# EAGLE board USB2LPT_1.7_adapter (EAGLE 7.5.0)
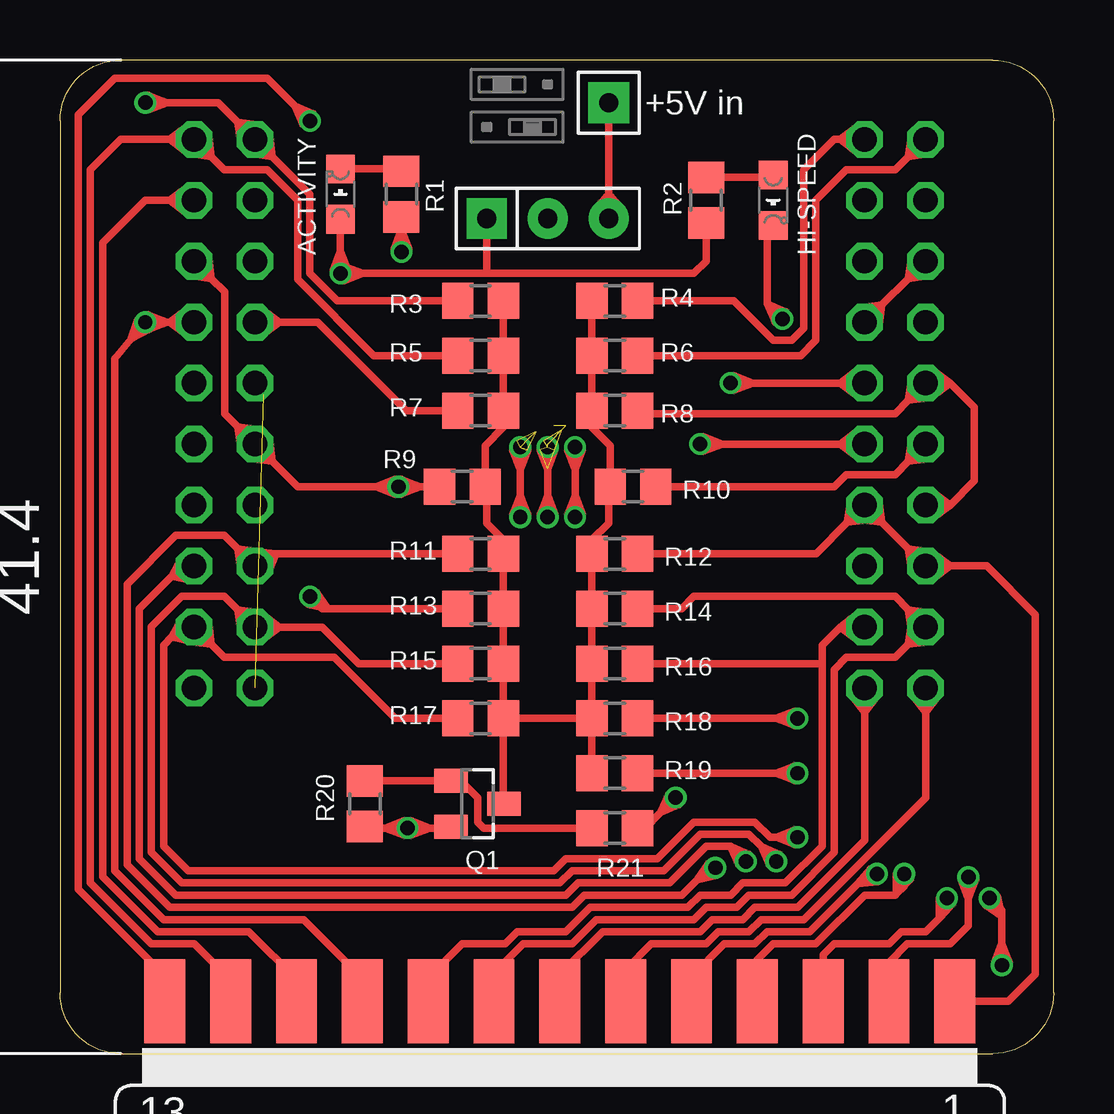
[diagram p1: board, top side]
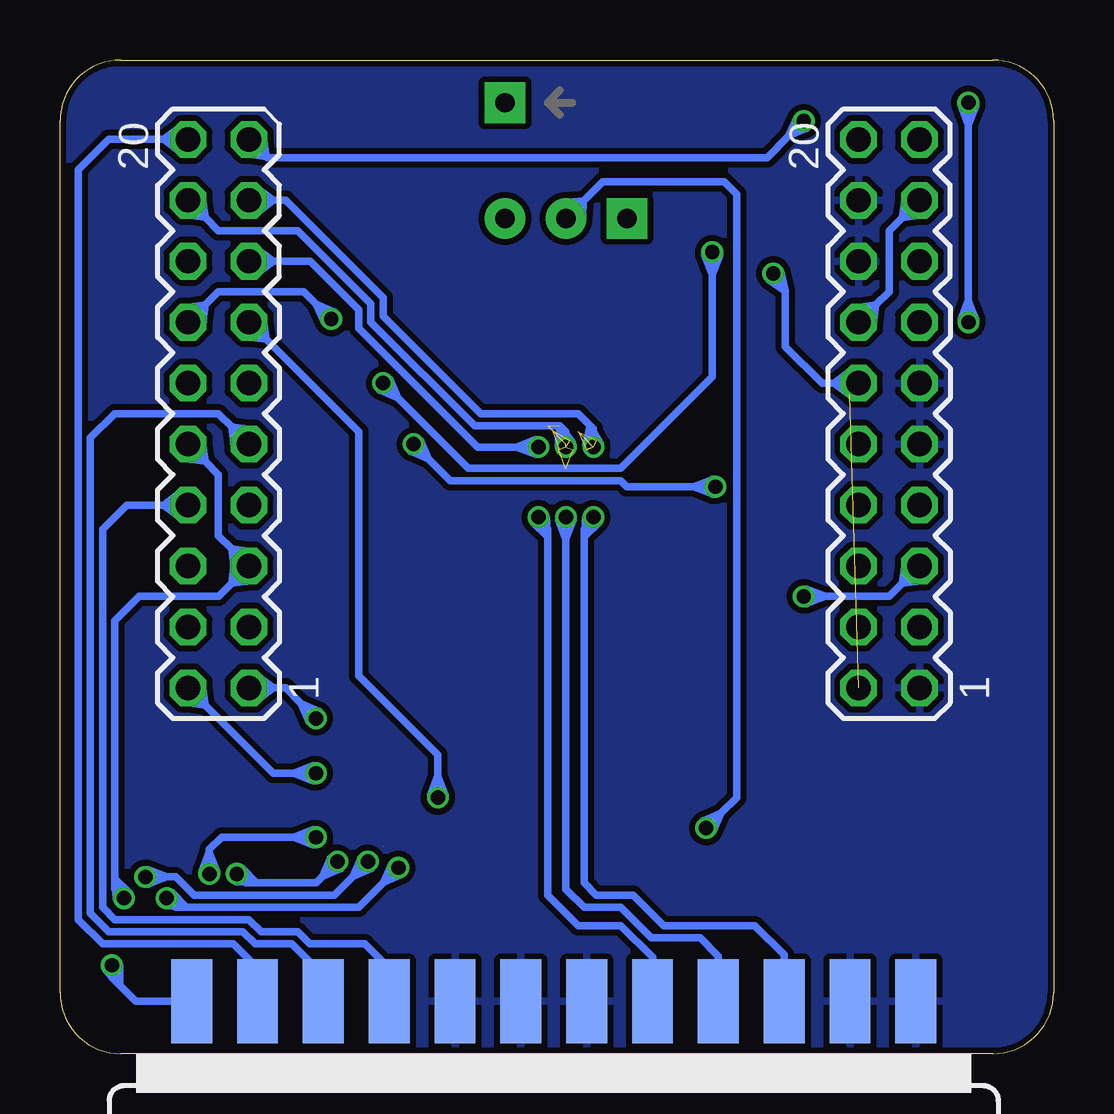
[diagram p2: board, bottom side, seen from below]

Size 41.4 x 41.4 mm. Coordinates in mm from the lower left corner, seen from the top.
Outline: 41.4,2.54 41.4,38.86 arc90 38.86,41.4 2.54,41.4 arc90 0,38.86 0,2.54 arc90 2.54,0 38.86,0 arc90 41.4,2.54
Copper layers (1*16): Top 0.035mm / dielectric 1.5mm / Bottom 0.035mm
Design rules "SeeedStudio_2layer_DRU_no_angle_20140221": minimum track width 6mil, minimum drill 12mil, track to track 6mil, track to pad 6mil, pad to pad 6mil, via to via 6mil, smd to smd 0mil, copper to edge 10mil, drill to drill 10mil, minimum pad ring 10mil, minimum via ring 6mil, stop-mask expansion 2mil, vias tented up to drill 100mil, thermal gap 10mil

## Footprints (pad centres in the part's own frame; a part is rotated, then mirrored left to right if it is on the bottom)
M1X2_08_17 = drill 0.8 pad 1.7 square: 1 0,0
LED-805 = smd 1.2 x 1.2: A 0,-1.05; C 0,1.05
SOT-23 = smd 1 x 1.4: 1 -0.95,-1.1; 2 0.95,-1.1; 3 0,1.1
R805 = smd 1.3 x 1.5: 1 -0.95,0; 2 0.95,0
HEADER_1X3 = drill 0.8 pad 1.676 square: 1 -2.54,0 | drill 0.8 pad 1.676: 2 0,0; 3 2.54,0
F25D = smd 1.7 x 3.5: 1 -16.459,-6.045; 2 -13.716,-6.045; 3 -10.973,-6.045; 4 -8.23,-6.045; 5 -5.486,-6.045; 6 -2.743,-6.045; 7 0,-6.045; 8 2.743,-6.045; 9 5.486,-6.045; 10 8.23,-6.045; 11 10.973,-6.045; 12 13.716,-6.045; 13 16.459,-6.045 | smd 1.7 x 3.5 bottom: 14 -15.088,-6.045; 15 -12.344,-6.045; 16 -9.601,-6.045; 17 -6.858,-6.045; 18 -4.115,-6.045; 19 -1.372,-6.045; 20 1.372,-6.045; 21 4.115,-6.045; 22 6.858,-6.045; 23 9.601,-6.045; 24 12.344,-6.045; 25 15.088,-6.045
MA10-2 = drill 1.016 octagon: 1 -11.43,-1.27; 2 -11.43,1.27; 3 -8.89,-1.27; 4 -8.89,1.27; 5 -6.35,-1.27; 6 -6.35,1.27; 7 -3.81,-1.27; 8 -3.81,1.27; 9 -1.27,-1.27; 10 -1.27,1.27; 11 1.27,-1.27; 12 1.27,1.27; 13 3.81,-1.27; 14 3.81,1.27; 15 6.35,-1.27; 16 6.35,1.27; 17 8.89,-1.27; 18 8.89,1.27; 19 11.43,-1.27; 20 11.43,1.27

## Placement (x,y rotation side)
$$U$2  [JUMP3_DESC_RIGHT]  19.05,38.61 0 top
+5V  CON_HEADER_1X01-PTH_08_17  [M1X2_08_17]  22.86,39.62 0 top
ACTIVITY  [LED-805]  11.68,35.81 0 top
HI-SPEED  [LED-805]  29.72,35.56 180 top
Q1  [SOT-23]  17.4,10.41 270 top
R1  470  [R805]  14.22,35.81 90 top
R2  470  [R805]  26.92,35.56 270 top
R3  4K7  [R805]  17.53,31.37 0 top
R4  4K7  [R805]  23.11,31.37 180 top
R5  4K7  [R805]  17.53,29.08 0 top
R6  4K7  [R805]  23.11,29.08 180 top
R7  4K7  [R805]  17.53,26.8 0 top
R8  2K2  [R805]  23.11,26.8 180 top
R9  2K2  [R805]  16.76,23.62 0 top
R10  2K2  [R805]  23.88,23.62 180 top
R11  4K7  [R805]  17.53,20.83 0 top
R12  2K2  [R805]  23.11,20.83 180 top
R13  4K7  [R805]  17.53,18.54 0 top
R14  4K7  [R805]  23.11,18.54 180 top
R15  4K7  [R805]  17.53,16.26 0 top
R16  4K7  [R805]  23.11,16.26 180 top
R17  4K7  [R805]  17.53,13.97 0 top
R18  4K7  [R805]  23.11,13.97 180 top
R19  4K7  [R805]  23.11,11.68 180 top
R20  470  [R805]  12.7,10.41 90 top
R21  470  [R805]  23.11,9.4 0 top
U$1  [JUMP3_DESC_LEFT]  19.05,40.39 0 top
VSELECT  VSELECT_HEADER  [HEADER_1X3]  20.32,34.8 0 top
X1  [F25D]  20.83,-3.87 180 top
X100  [MA10-2]  34.8,26.67 90 bottom
X101  [MA10-2]  6.86,26.67 90 bottom

## Tracks (layer width: path | path; a pad name or v marks a point on that pad's centre or on a via)
5V_PAD
  Top 0.305: +5V.1 22.86,35.6 | 22.86,35.6 | 22.86,35.6 | 22.86,35.6 | 22.86,35.6 | 22.86,35.6 VSELECT.3
  Top 0.61: 22.86,35.6 22.46,35.15 VSELECT.3 23.26,35.15 22.86,35.6
+3V3  (via drill 0.6)  (1 unrouted)
  Top 0.305: ACTIVITY.A 11.68,33.41 | 11.68,33.41 v11.68,32.51 | v11.68,32.51 12.58,32.51 | 12.58,32.51 17.78,32.51 | 17.78,32.51 26.42,32.51 26.92,33.02 R2.2 | VSELECT.1 17.78,32.51 | 11.68,33.41 11.4,32.61 v11.68,32.51 | 11.68,33.41 11.97,32.61 v11.68,32.51 | 12.58,32.51 11.78,32.8 v11.68,32.51 | 12.58,32.51 11.78,32.23 v11.68,32.51 | 11.68,33.41 11.38,32.63 | 11.38,32.63 | 12.58,32.51 11.8,32.81 | 11.8,32.81 | 11.68,33.41 11.38,32.63 | v11.68,32.51 11.38,32.63 | 11.68,33.41 11.99,32.63 | 11.99,32.63 | 11.68,33.41 | 11.68,33.41 11.99,32.63 | v11.68,32.51 11.99,32.63 | 12.58,32.51 11.8,32.81 | v11.68,32.51 11.8,32.81 | 12.58,32.51 | 12.58,32.51 11.8,32.21 | 11.8,32.21 | 12.58,32.51 11.8,32.21 | v11.68,32.51 11.8,32.21 | 11.68,33.41 11.38,32.63 | 11.38,32.63 | 11.68,33.41 11.38,32.63 | v11.68,32.51 11.38,32.63 | 11.68,33.41 11.99,32.63 | 11.99,32.63 | v11.68,32.51 11.99,32.63 | 11.68,33.41 11.38,32.63 | 11.68,33.41 11.99,32.63 | 11.68,33.41 11.38,32.63 | v11.68,32.51 11.38,32.63 | 11.68,33.41 11.99,32.63 | v11.68,32.51 11.99,32.63 | 12.58,32.51 11.8,32.21 | 11.8,32.21 | 12.58,32.51 11.8,32.81 | 11.8,32.81 | v11.68,32.51 11.8,32.81 | 12.58,32.51 11.8,32.21 | v11.68,32.51 11.8,32.21 | 12.58,32.51 11.8,32.81 | v11.68,32.51 11.8,32.81 | 12.58,32.51 11.8,32.21 | v11.68,32.51 11.8,32.21
  Bottom 0.305: X101.12 9.14,27.94 | 9.14,27.94 | 9.14,27.94 9.65,27.94 11.18,29.46 11.18,31.75 11.19,31.76 | 11.19,31.76 v11.68,32.51 | 11.19,31.76 11.86,32.27 v11.68,32.51 | 11.19,31.76 11.39,32.59 v11.68,32.51 | 11.19,31.76 11.87,32.25 v11.68,32.51 | 11.19,31.76 11.37,32.58 v11.68,32.51 | 9.14,27.94 8.49,28.42 | 9.14,27.94 8.49,28.42 | 8.49,28.42 | 9.14,27.94 | 9.14,27.94 8.49,28.42 | X101.12 8.49,28.42 | 9.14,27.94 | 9.14,27.94 8.49,28.42 | 9.14,27.94 | 9.14,27.94 8.49,27.45 | X101.12 8.49,27.45 | 9.14,27.94 8.49,28.42 | 8.49,28.42 | 9.14,27.94 8.49,27.45 | 9.14,27.94 8.49,28.42 | X101.12 8.49,28.42 | 9.14,27.94 8.49,27.45 | 8.49,27.45 | X101.12 8.49,27.45 | 9.14,27.94 8.49,28.42 | X101.12 8.49,28.42 | 9.14,27.94 8.49,27.45 | X101.12 8.49,27.45 | 9.14,27.94 8.49,28.42 | X101.12 8.49,28.42 | 9.14,27.94 8.49,27.45 | X101.12 8.49,27.45
CTL0
  Top 0.305: X100.7 34.25,22.14 | 34.25,22.14 35.35,21.03 | 35.35,21.03 X100.6 | X100.6 37.08,20.32 | 37.08,20.32 38.61,20.32 40.64,18.29 40.64,3.3 39.52,2.18 X1.1 | R12.1 31.5,20.83 32.81,22.14 | X100.7 | 32.81,22.14 X100.7 | 35.35,21.03 35.46,20.23 X100.6 | 35.35,21.03 36.15,20.92 X100.6 | 37.08,20.32 36.43,20.8 X100.6 | 37.08,20.32 36.44,19.83 X100.6 | 34.25,22.14 34.13,22.94 X100.7 | 34.25,22.14 33.44,22.25 X100.7 | 32.81,22.14 33.61,22.25 X100.7 | 32.81,22.14 32.92,22.94 X100.7
CTL1  (via drill 0.6)
  Top 0.305: 35.35,24.68 34.8,24.13 32.77,24.13 32.26,23.62 R10.1 | 35.35,24.68 X100.10 | v38.73,6.48 39.24,5.97 39.24,5.73 | 39.24,5.73 39.24,4.58 | 39.24,4.58 v39.24,3.68 | 39.24,5.73 39.02,6.55 v38.73,6.48 | 39.24,5.73 38.56,6.24 v38.73,6.48 | 39.24,4.58 38.96,3.78 v39.24,3.68 | 39.24,4.58 39.53,3.78 v39.24,3.68 | 39.24,5.73 39.05,6.55 v38.73,6.48 | 39.24,5.73 38.55,6.21 v38.73,6.48 | 39.24,4.58 38.94,3.8 | 38.94,3.8 | 39.24,4.58 38.94,3.8 | v39.24,3.68 38.94,3.8 | 39.24,4.58 39.55,3.8 | 39.55,3.8 | 39.24,4.58 | 39.24,4.58 39.55,3.8 | v39.24,3.68 39.55,3.8 | 39.24,4.58 38.94,3.8 | 38.94,3.8 | 39.24,4.58 38.94,3.8 | v39.24,3.68 38.94,3.8 | 39.24,4.58 39.55,3.8 | 39.55,3.8 | v39.24,3.68 39.55,3.8 | 39.24,4.58 38.94,3.8 | 39.24,4.58 39.55,3.8 | 39.24,4.58 38.94,3.8 | v39.24,3.68 38.94,3.8 | 39.24,4.58 39.55,3.8 | v39.24,3.68 39.55,3.8 | 35.35,24.68 36.15,24.79 X100.10 | 35.35,24.68 35.46,25.48 X100.10
  Bottom 0.305: 34.25,19.6 34.79,19.05 38.1,19.05 39.12,18.03 39.12,7.29 | 34.25,19.6 X100.5 | X100.5 34.25,21.03 | 34.25,21.03 34.8,21.59 34.8,24.13 35.35,24.68 | 35.35,24.68 X100.10 | 39.12,7.29 39.12,6.86 v38.73,6.48 | 36.02,2.29 X1.14 38.25,2.18 38.91,2.85 | v39.24,3.68 39.24,3.18 38.91,2.85 | 39.12,7.29 38.52,6.69 v38.73,6.48 | 39.12,7.29 39.03,6.45 v38.73,6.48 | 38.91,2.85 39.47,3.49 v39.24,3.68 | 38.91,2.85 38.94,3.69 v39.24,3.68 | 39.12,7.29 38.51,6.71 v38.73,6.48 | 39.12,7.29 39.06,6.46 v38.73,6.48 | 38.91,2.85 39.48,3.46 | v39.24,3.68 39.48,3.46 | 38.91,2.85 | 38.91,2.85 38.92,3.69 | v39.24,3.68 38.92,3.69 | 38.91,2.85 39.48,3.46 | v39.24,3.68 39.48,3.46 | 38.91,2.85 38.92,3.69 | v39.24,3.68 38.92,3.69 | 34.25,19.6 34.13,20.4 X100.5 | 34.25,19.6 33.44,19.71 X100.5 | 34.25,21.03 33.44,20.92 X100.5 | 34.25,21.03 34.13,20.23 X100.5 | 35.35,24.68 36.15,24.79 X100.10 | 35.35,24.68 35.46,25.48 X100.10
CTL2
  Top 0.305: X100.12 37.08,27.94 | 37.08,27.94 | 37.08,27.94 37.09,27.94 38.1,26.92 38.1,23.87 37.08,22.86 | 37.08,22.86 X100.8 | X100.12 35.35,27.22 | 35.35,27.22 34.8,26.67 24.19,26.67 R8.1 | 37.08,22.86 36.43,23.34 | 37.08,22.86 36.43,23.34 | 36.43,23.34 | 37.08,22.86 | 37.08,22.86 36.43,23.34 | X100.8 36.43,23.34 | 37.08,22.86 | 37.08,22.86 36.43,23.34 | 37.08,22.86 | 37.08,22.86 36.43,22.37 | X100.8 36.43,22.37 | 37.08,22.86 36.43,23.34 | 36.43,23.34 | 37.08,22.86 36.43,22.37 | 37.08,22.86 36.43,23.34 | X100.8 36.43,23.34 | 37.08,22.86 36.43,22.37 | 36.43,22.37 | X100.8 36.43,22.37 | 37.08,22.86 36.43,23.34 | X100.8 36.43,23.34 | 37.08,22.86 36.43,22.37 | X100.8 36.43,22.37 | 37.08,22.86 36.43,23.34 | X100.8 36.43,23.34 | 37.08,22.86 36.43,22.37 | X100.8 36.43,22.37 | 37.08,27.94 36.43,28.42 | 37.08,27.94 36.43,28.42 | 36.43,28.42 | 37.08,27.94 | 37.08,27.94 36.43,28.42 | X100.12 36.43,28.42 | 37.08,27.94 | 37.08,27.94 36.43,28.42 | 37.08,27.94 | 37.08,27.94 36.43,27.45 | X100.12 36.43,27.45 | 37.08,27.94 36.43,28.42 | 36.43,28.42 | 37.08,27.94 36.43,27.45 | 37.08,27.94 36.43,28.42 | X100.12 36.43,28.42 | 37.08,27.94 36.43,27.45 | 36.43,27.45 | X100.12 36.43,27.45 | 37.08,27.94 36.43,28.42 | X100.12 36.43,28.42 | 37.08,27.94 36.43,27.45 | X100.12 36.43,27.45 | 37.08,27.94 36.43,28.42 | X100.12 36.43,28.42 | 37.08,27.94 36.43,27.45 | X100.12 36.43,27.45 | 35.35,27.22 36.15,27.33 X100.12 | 35.35,27.22 35.46,28.02 X100.12
  Bottom 0.305: X100.8 37.08,22.86 | 37.08,22.86 | 37.08,22.86 38.61,22.86 39.62,21.84 39.62,6.1 39.12,5.59 33.53,5.59 33.02,5.08 31.5,5.08 30.99,4.57 28.7,4.57 27.94,3.81 27.94,2.43 X1.17 | 37.08,22.86 36.43,23.34 | 37.08,22.86 36.43,23.34 | 36.43,23.34 | 37.08,22.86 | 37.08,22.86 36.43,23.34 | X100.8 36.43,23.34 | 37.08,22.86 | 37.08,22.86 36.43,23.34 | 37.08,22.86 | 37.08,22.86 36.43,22.37 | X100.8 36.43,22.37 | 37.08,22.86 36.43,23.34 | 36.43,23.34 | 37.08,22.86 36.43,22.37 | 37.08,22.86 36.43,23.34 | X100.8 36.43,23.34 | 37.08,22.86 36.43,22.37 | 36.43,22.37 | X100.8 36.43,22.37 | 37.08,22.86 36.43,23.34 | X100.8 36.43,23.34 | 37.08,22.86 36.43,22.37 | X100.8 36.43,22.37 | 37.08,22.86 36.43,23.34 | X100.8 36.43,23.34 | 37.08,22.86 36.43,22.37 | X100.8 36.43,22.37
GND
  pour Bottom (isolate 0.254): -1.78,-2.03 43.69,-2.29 43.69,42.67 -1.78,42.67
IFCLK  (via drill 0.6)
  Top 0.305: X101.15 6.31,32.3 | 6.31,32.3 6.86,31.75 6.86,26.67 7.41,26.12 | 7.41,26.12 X101.10 | X101.10 | X101.10 8.85,24.68 | 8.85,24.68 9.91,23.62 13.2,23.62 | 13.2,23.62 v14.1,23.62 | v14.1,23.62 15,23.62 | 15,23.62 R9.1 | v26.67,25.4 27.57,25.4 | 27.57,25.4 32.51,25.4 | 32.51,25.4 X100.9 | 13.2,23.62 14,23.34 v14.1,23.62 | 13.2,23.62 14,23.91 v14.1,23.62 | 15,23.62 14.2,23.91 v14.1,23.62 | 15,23.62 14.2,23.34 v14.1,23.62 | 27.57,25.4 26.77,25.68 v26.67,25.4 | 27.57,25.4 26.77,25.12 v26.67,25.4 | 13.2,23.62 13.98,23.32 | 13.98,23.32 | 15,23.62 14.21,23.93 | 14.21,23.93 | 13.2,23.62 13.98,23.32 | v14.1,23.62 13.98,23.32 | 13.2,23.62 13.98,23.93 | 13.98,23.93 | 13.2,23.62 | 13.2,23.62 13.98,23.93 | v14.1,23.62 13.98,23.93 | 15,23.62 14.21,23.93 | v14.1,23.62 14.21,23.93 | 15,23.62 | 15,23.62 14.21,23.32 | 14.21,23.32 | 15,23.62 14.21,23.32 | v14.1,23.62 14.21,23.32 | 13.2,23.62 13.98,23.32 | 13.98,23.32 | 13.2,23.62 13.98,23.32 | v14.1,23.62 13.98,23.32 | 13.2,23.62 13.98,23.93 | 13.98,23.93 | v14.1,23.62 13.98,23.93 | 13.2,23.62 13.98,23.32 | 13.2,23.62 13.98,23.93 | 13.2,23.62 13.98,23.32 | v14.1,23.62 13.98,23.32 | 13.2,23.62 13.98,23.93 | v14.1,23.62 13.98,23.93 | 15,23.62 14.21,23.32 | 14.21,23.32 | 15,23.62 14.21,23.93 | 14.21,23.93 | v14.1,23.62 14.21,23.93 | 15,23.62 14.21,23.32 | v14.1,23.62 14.21,23.32 | 15,23.62 14.21,23.93 | v14.1,23.62 14.21,23.93 | 15,23.62 14.21,23.32 | v14.1,23.62 14.21,23.32 | 27.57,25.4 26.79,25.7 | 26.79,25.7 | 27.57,25.4 26.79,25.7 | v26.67,25.4 26.79,25.7 | 27.57,25.4 | 27.57,25.4 26.79,25.1 | 26.79,25.1 | 27.57,25.4 26.79,25.1 | v26.67,25.4 26.79,25.1 | 27.57,25.4 26.79,25.1 | 26.79,25.1 | 27.57,25.4 26.79,25.7 | 26.79,25.7 | v26.67,25.4 26.79,25.7 | 27.57,25.4 26.79,25.1
  Top 0.305: v26.67,25.4 26.79,25.1 | 27.57,25.4 26.79,25.7 | v26.67,25.4 26.79,25.7 | 27.57,25.4 26.79,25.1 | v26.67,25.4 26.79,25.1 | 7.41,26.12 7.52,25.31 X101.10 | 7.41,26.12 8.22,26 X101.10 | 8.85,24.68 8.73,25.48 X101.10 | 8.85,24.68 8.04,24.79 X101.10 | 6.31,32.3 6.19,33.1 X101.15 | 6.31,32.3 5.5,32.41 X101.15 | 32.51,25.4 33.16,24.91 X100.9 | 32.51,25.4 33.16,25.89 X100.9
  Bottom 0.305: X100.9 | v26.67,25.4 26.03,24.76 | 26.03,24.76 25.15,23.88 18.03,23.88 17.78,23.62 15,23.62 | X100.9 34.25,26.11 | 34.25,26.11 34.8,26.67 39.12,26.67 40.13,25.65 40.13,5.84 39.37,5.08 33.78,5.08 33.27,4.57 31.75,4.57 30.23,3.05 30.23,2.38 X1.16 | v14.1,23.62 15,23.62 | 15,23.62 14.2,23.91 v14.1,23.62 | 15,23.62 14.2,23.34 v14.1,23.62 | 26.03,24.76 26.8,25.13 v26.67,25.4 | 26.03,24.76 26.4,25.53 v26.67,25.4 | 15,23.62 14.21,23.93 | 14.21,23.93 | 15,23.62 14.21,23.93 | v14.1,23.62 14.21,23.93 | 15,23.62 | 15,23.62 14.21,23.32 | 14.21,23.32 | 15,23.62 14.21,23.32 | v14.1,23.62 14.21,23.32 | 15,23.62 14.21,23.32 | 14.21,23.32 | 15,23.62 14.21,23.93 | 14.21,23.93 | v14.1,23.62 14.21,23.93 | 15,23.62 14.21,23.32 | v14.1,23.62 14.21,23.32 | 15,23.62 14.21,23.93 | v14.1,23.62 14.21,23.93 | 15,23.62 14.21,23.32 | v14.1,23.62 14.21,23.32 | 26.03,24.76 26.8,25.1 v26.67,25.4 | 26.03,24.76 26.37,25.53 v26.67,25.4 | 34.25,26.11 33.44,26 X100.9 | 34.25,26.11 34.13,25.31 X100.9
N$1
  Top 0.305: R2.1 29.72,36.51 HI-SPEED.A
N$5
  Top 0.305: 14.12,36.86 R1.2 13.87,36.86 ACTIVITY.C
N$8
  Top 0.305: R20.2 Q1.1 | R21.1 17.65,9.4 17.4,9.65 17.4,10.67 16.7,11.36 Q1.1 | 16.83,11.36 Q1.1
PA4  (via drill 0.6)
  Top 0.305: X100.11 | v27.94,27.94 28.84,27.94 | 28.84,27.94 32.51,27.94 | 32.51,27.94 X100.11 | v14.22,33.4 14.22,34.3 | 14.22,34.3 R1.1 | 14.22,34.3 13.94,33.5 v14.22,33.4 | 14.22,34.3 14.51,33.5 v14.22,33.4 | 28.84,27.94 28.04,28.22 v27.94,27.94 | 28.84,27.94 28.04,27.66 v27.94,27.94 | 14.22,34.3 13.92,33.52 | 13.92,33.52 | 14.22,34.3 13.92,33.52 | v14.22,33.4 13.92,33.52 | 14.22,34.3 14.53,33.52 | 14.53,33.52 | 14.22,34.3 | 14.22,34.3 14.53,33.52 | v14.22,33.4 14.53,33.52 | 14.22,34.3 13.92,33.52 | 13.92,33.52 | 14.22,34.3 13.92,33.52 | v14.22,33.4 13.92,33.52 | 14.22,34.3 14.53,33.52 | 14.53,33.52 | v14.22,33.4 14.53,33.52 | 14.22,34.3 13.92,33.52 | 14.22,34.3 14.53,33.52 | 14.22,34.3 13.92,33.52 | v14.22,33.4 13.92,33.52 | 14.22,34.3 14.53,33.52 | v14.22,33.4 14.53,33.52 | 28.84,27.94 28.06,28.24 | 28.06,28.24 | 28.84,27.94 28.06,28.24 | v27.94,27.94 28.06,28.24 | 28.84,27.94 | 28.84,27.94 28.06,27.64 | 28.06,27.64 | 28.84,27.94 28.06,27.64 | v27.94,27.94 28.06,27.64 | 28.84,27.94 28.06,27.64 | 28.06,27.64 | 28.84,27.94 28.06,28.24 | 28.06,28.24 | v27.94,27.94 28.06,28.24 | 28.84,27.94 28.06,27.64 | v27.94,27.94 28.06,27.64 | 28.84,27.94 28.06,28.24 | v27.94,27.94 28.06,28.24 | 28.84,27.94 28.06,27.64 | v27.94,27.94 28.06,27.64 | 32.51,27.94 33.16,27.45 X100.11 | 32.51,27.94 33.16,28.43 X100.11
  Bottom 0.305: v14.22,33.4 14.22,32.5 | 14.22,32.5 14.22,28.19 18.03,24.38 24.38,24.38 27.3,27.3 | 27.3,27.3 v27.94,27.94 | 14.22,32.5 14.51,33.3 v14.22,33.4 | 14.22,32.5 13.94,33.3 v14.22,33.4 | 27.3,27.3 28.07,27.67 v27.94,27.94 | 27.3,27.3 27.67,28.07 v27.94,27.94 | 14.22,32.5 14.53,33.28 | 14.53,33.28 | 14.22,32.5 14.53,33.28 | v14.22,33.4 14.53,33.28 | 14.22,32.5 | 14.22,32.5 13.92,33.28 | 13.92,33.28 | 14.22,32.5 13.92,33.28 | v14.22,33.4 13.92,33.28 | 14.22,32.5 13.92,33.28 | 13.92,33.28 | 14.22,32.5 14.53,33.28 | 14.53,33.28 | v14.22,33.4 14.53,33.28 | 14.22,32.5 13.92,33.28 | v14.22,33.4 13.92,33.28 | 14.22,32.5 14.53,33.28 | v14.22,33.4 14.53,33.28 | 14.22,32.5 13.92,33.28 | v14.22,33.4 13.92,33.28 | 27.3,27.3 28.07,27.64 v27.94,27.94 | 27.3,27.3 27.64,28.07 v27.94,27.94
PA5  (via drill 0.6)
  Top 0.305: 29.46,31.25 29.46,31.24 v30.1,30.61 | 29.46,31.25 29.83,30.48 v30.1,30.61 | 29.46,31.25 30.23,30.88 v30.1,30.61 | 29.46,31.25 29.8,30.48 v30.1,30.61 | 29.46,31.25 30.23,30.9 v30.1,30.61 | HI-SPEED.C 29.46,34.51 29.46,31.25
  Bottom 0.305: 35.35,31.2 34.8,31.75 31.24,31.75 30.73,31.24 | 35.35,31.2 X100.14 | 30.73,31.24 v30.1,30.61 | 30.73,31.24 29.97,30.88 v30.1,30.61 | 30.73,31.24 30.37,30.48 v30.1,30.61 | 30.73,31.24 29.97,30.9 v30.1,30.61 | 30.73,31.24 30.4,30.48 v30.1,30.61 | 35.35,31.2 35.46,30.39 X100.14 | 35.35,31.2 36.16,31.08 X100.14
PA6  (via drill 0.6)
  Top 0.305: X100.16 35.35,32.3 | 35.35,32.3 34.25,31.19 | 34.25,31.19 X100.13 | R21.2 24.38,9.4 25.02,10.03 | 25.02,10.03 v25.65,10.67 | 25.02,10.03 25.78,10.4 v25.65,10.67 | 25.02,10.03 25.38,10.8 v25.65,10.67 | 25.02,10.03 25.79,10.37 v25.65,10.67 | 25.02,10.03 25.36,10.8 v25.65,10.67 | 34.25,31.19 33.44,31.08 X100.13 | 34.25,31.19 34.13,30.39 X100.13 | 35.35,32.3 36.15,32.41 X100.16 | 35.35,32.3 35.46,33.1 X100.16
  Bottom 0.305: 32.81,29.76 28.96,25.9 28.96,15.75 25.65,12.45 25.65,11.57 | 32.81,29.76 X100.13 | v25.65,10.67 25.65,11.57 | 25.65,11.57 25.37,10.77 v25.65,10.67 | 25.65,11.57 25.94,10.77 v25.65,10.67 | 25.65,11.57 25.35,10.79 | 25.35,10.79 | 25.65,11.57 25.35,10.79 | v25.65,10.67 25.35,10.79 | 25.65,11.57 25.96,10.79 | 25.96,10.79 | 25.65,11.57 | 25.65,11.57 25.96,10.79 | v25.65,10.67 25.96,10.79 | 25.65,11.57 25.35,10.79 | 25.35,10.79 | 25.65,11.57 25.35,10.79 | v25.65,10.67 25.35,10.79 | 25.65,11.57 25.96,10.79 | 25.96,10.79 | v25.65,10.67 25.96,10.79 | 25.65,11.57 25.35,10.79 | 25.65,11.57 25.96,10.79 | 25.65,11.57 25.35,10.79 | v25.65,10.67 25.35,10.79 | 25.65,11.57 25.96,10.79 | v25.65,10.67 25.96,10.79 | 32.81,29.76 33.61,29.87 X100.13 | 32.81,29.76 32.92,30.56 X100.13
PB0  (via drill 0.6)  (1 unrouted)
  Top 0.305: 34.54,1.52 X1.2 34.54,3.81 35.31,4.57 37.08,4.57 37.85,5.33 37.85,6.47 | X101.5 5.08,20.32 4.66,19.9 | 4.66,19.9 3.3,18.54 3.3,8.13 4.83,6.6 21.08,6.6 21.59,7.11 25.4,7.11 26.92,8.64 27.94,8.64 | v37.85,7.37 37.85,6.47 | R13.1 11.16,18.54 | 11.16,18.54 10.92,18.54 v10.41,19.05 | 11.16,18.54 10.66,19.23 v10.41,19.05 | 11.16,18.54 10.34,18.76 v10.41,19.05 | 37.85,6.47 38.13,7.27 v37.85,7.37 | 37.85,6.47 37.56,7.27 v37.85,7.37 | 27.94,8.64 | 27.94,8.64 v28.57,8 | 11.16,18.54 10.68,19.23 v10.41,19.05 | 11.16,18.54 10.34,18.73 v10.41,19.05 | 37.85,6.47 38.15,7.25 | 38.15,7.25 | 37.85,6.47 38.15,7.25 | v37.85,7.37 38.15,7.25 | 37.85,6.47 | 37.85,6.47 37.54,7.25 | 37.54,7.25 | 37.85,6.47 37.54,7.25 | v37.85,7.37 37.54,7.25 | 37.85,6.47 37.54,7.25 | 37.54,7.25 | 37.85,6.47 38.15,7.25 | 38.15,7.25 | v37.85,7.37 38.15,7.25 | 37.85,6.47 37.54,7.25 | v37.85,7.37 37.54,7.25 | 37.85,6.47 38.15,7.25 | v37.85,7.37 38.15,7.25 | 37.85,6.47 37.54,7.25 | v37.85,7.37 37.54,7.25 | 27.94,8.64 28.28,7.87 v28.57,8 | 27.94,8.64 28.71,8.3 | v28.57,8 28.71,8.3 | 27.94,8.64 28.28,7.87 v28.57,8 | 27.94,8.64 28.71,8.3 | v28.57,8 28.71,8.3 | 4.66,19.9 5.45,19.72 X101.5 | 4.66,19.9 5.05,20.61 X101.5
  Bottom 0.305: X101.5 6.31,19.6 | 6.31,19.6 6.85,19.05 9.51,19.05 | 9.51,19.05 v10.41,19.05 | 29.21,7.37 29.97,6.6 35.81,6.6 36.58,7.37 36.95,7.37 | 29.21,7.37 v28.57,8 | 36.95,7.37 v37.85,7.37 | 9.51,19.05 10.31,18.77 v10.41,19.05 | 9.51,19.05 10.31,19.33 v10.41,19.05 | 36.95,7.37 37.75,7.08 v37.85,7.37 | 36.95,7.37 37.75,7.65 v37.85,7.37 | 29.21,7.37 28.85,8.13 v28.57,8 | 29.21,7.37 28.45,7.73 v28.57,8 | 9.51,19.05 10.3,18.75 | 10.3,18.75 | 9.51,19.05 10.3,18.75 | v10.41,19.05 10.3,18.75 | 9.51,19.05 10.3,19.35 | 10.3,19.35 | 9.51,19.05 | 9.51,19.05 10.3,19.35 | v10.41,19.05 10.3,19.35 | 9.51,19.05 10.3,18.75 | 10.3,18.75 | 9.51,19.05 10.3,18.75 | v10.41,19.05 10.3,18.75 | 9.51,19.05 10.3,19.35 | 10.3,19.35 | v10.41,19.05 10.3,19.35 | 9.51,19.05 10.3,18.75 | 9.51,19.05 10.3,19.35 | 9.51,19.05 10.3,18.75 | v10.41,19.05 10.3,18.75 | 9.51,19.05 10.3,19.35 | v10.41,19.05 10.3,19.35 | 36.95,7.37 37.73,7.06 | 37.73,7.06 | 36.95,7.37 37.73,7.06 | v37.85,7.37 37.73,7.06 | 36.95,7.37 37.73,7.67 | 37.73,7.67 | 36.95,7.37 | 36.95,7.37 37.73,7.67 | v37.85,7.37 37.73,7.67 | 36.95,7.37 37.73,7.06 | 37.73,7.06 | 36.95,7.37 37.73,7.06 | v37.85,7.37 37.73,7.06 | 36.95,7.37 37.73,7.67 | 37.73,7.67 | v37.85,7.37 37.73,7.67 | 36.95,7.37 37.73,7.06 | 36.95,7.37 37.73,7.67 | 36.95,7.37 37.73,7.06 | v37.85,7.37 37.73,7.06 | 36.95,7.37 37.73,7.67 | v37.85,7.37 37.73,7.67 | 29.21,7.37 28.87,8.13 v28.57,8 | 29.21,7.37 28.44,7.7 v28.57,8 | 6.31,19.6 6.19,20.4 X101.5 | 6.31,19.6 5.5,19.71 X101.5
PB1  (via drill 0.6)
  Top 0.305: 31.8,1.73 X1.3 31.8,4.12 32.26,4.57 34.54,4.57 35.05,5.08 36.07,5.08 36.63,5.64 | 7.41,21.03 6.85,21.59 4.83,21.59 2.79,19.56 2.79,7.87 4.57,6.1 21.34,6.1 21.84,6.6 25.91,6.6 26.55,7.25 | 7.41,21.03 X101.6 | R11.1 9.01,20.83 | 9.01,20.83 8.64,20.83 X101.6 | 36.63,5.64 36.96,5.97 v36.96,6.48 | 36.63,5.64 37.18,6.28 v36.96,6.48 | 36.63,5.64 36.66,6.49 v36.96,6.48 | 26.55,7.25 27.05,7.75 v27.3,7.75 | 36.63,5.64 37.2,6.26 | v36.96,6.48 37.2,6.26 | 36.63,5.64 | 36.63,5.64 36.63,6.48 | v36.96,6.48 36.63,6.48 | 36.63,5.64 37.2,6.26 | v36.96,6.48 37.2,6.26 | 36.63,5.64 36.63,6.48 | v36.96,6.48 36.63,6.48 | 26.55,7.25 27.37,7.43 v27.3,7.75 | 26.55,7.25 27.04,7.94 v27.3,7.75 | 7.41,21.03 7.53,20.23 X101.6 | 7.41,21.03 8.21,20.92 X101.6 | 9.01,20.83 8.2,20.92 X101.6 | 9.01,20.83 8.69,20.08 X101.6
  Bottom 0.305: 36.14,6.1 28.96,6.1 27.94,7.11 | 36.14,6.1 36.58,6.1 v36.96,6.48 | 36.14,6.1 36.99,6.18 v36.96,6.48 | 36.14,6.1 36.75,6.69 v36.96,6.48 | 27.94,7.11 v27.3,7.75 | 36.14,6.1 36.98,6.15 v36.96,6.48 | 36.14,6.1 36.72,6.7 v36.96,6.48 | 27.94,7.11 27.6,7.88 v27.3,7.75 | 27.94,7.11 27.17,7.45 v27.3,7.75
PB2  (via drill 0.6)
  Top 0.305: X101.3 5.08,17.78 4.66,17.36 | 4.66,17.36 4.32,17.02 4.32,8.64 5.33,7.62 20.57,7.62 21.08,8.13 24.89,8.13 26.42,9.65 28.96,9.65 29.59,9.02 29.83,9.02 | 29.06,2.95 X1.4 29.06,3.91 29.72,4.57 31.5,4.57 33.53,6.6 34.8,6.6 34.85,6.66 | X101.3 6.31,17.06 | 6.31,17.06 6.85,16.51 11.43,16.51 13.97,13.97 R17.1 | 34.85,6.66 35.18,6.99 v35.18,7.49 | 29.83,9.02 v30.73,9.02 | 34.85,6.66 35.42,7.27 | v35.18,7.49 35.42,7.27 | 34.85,6.66 | 34.85,6.66 34.85,7.5 | v35.18,7.49 34.85,7.5 | 34.85,6.66 35.42,7.27 | v35.18,7.49 35.42,7.27 | 34.85,6.66 34.85,7.5 | v35.18,7.49 34.85,7.5 | 29.83,9.02 30.62,8.71 v30.73,9.02 | 29.83,9.02 30.62,9.32 v30.73,9.02 | 4.66,17.36 5.45,17.18 X101.3 | 4.66,17.36 5.05,18.07 X101.3 | 6.31,17.06 6.19,17.86 X101.3 | 6.31,17.06 5.5,17.17 X101.3
  Bottom 0.305: v30.73,9.02 31.63,9.02 | 31.63,9.02 30.83,9.3 v30.73,9.02 | 31.63,9.02 30.83,8.73 v30.73,9.02 | 31.63,9.02 34.67,9.02 35.18,8.51 35.18,8.39 | 35.18,8.39 | 35.18,8.39 v35.18,7.49 | 35.18,8.39 34.88,7.61 | 35.18,8.39 35.48,7.61 | 35.48,7.61 | v35.18,7.49 35.48,7.61 | 35.18,8.39 34.88,7.61 | 34.88,7.61 | 35.18,8.39 | 35.18,8.39 34.88,7.61 | 34.88,7.61 | v35.18,7.49 34.88,7.61 | 35.18,8.39 35.48,7.61 | 35.18,8.39 34.88,7.61 | v35.18,7.49 34.88,7.61 | 35.18,8.39 35.48,7.61 | 35.48,7.61 | v35.18,7.49 35.48,7.61 | 35.18,8.39 34.88,7.61 | v35.18,7.49 34.88,7.61 | 35.18,8.39 35.48,7.61 | v35.18,7.49 35.48,7.61 | 31.63,9.02 30.85,9.32 | 30.85,9.32 | 31.63,9.02 30.85,9.32 | v30.73,9.02 30.85,9.32 | 31.63,9.02 | 31.63,9.02 30.85,8.71 | 30.85,8.71 | 31.63,9.02 30.85,8.71 | v30.73,9.02 30.85,8.71 | 31.63,9.02 30.85,8.71 | 30.85,8.71 | 31.63,9.02 30.85,9.32 | 30.85,9.32 | v30.73,9.02 30.85,9.32 | 31.63,9.02 30.85,8.71 | v30.73,9.02 30.85,8.71 | 31.63,9.02 30.85,9.32 | v30.73,9.02 30.85,9.32 | 31.63,9.02 30.85,8.71 | v30.73,9.02 30.85,8.71
PB3  (via drill 0.6)
  Top 0.305: X101.4 7.41,18.49 | 7.41,18.49 6.85,19.05 5.08,19.05 3.81,17.78 3.81,8.38 5.08,7.11 20.83,7.11 21.34,7.62 25.15,7.62 26.67,9.14 28.7,9.14 29.21,8.64 | X1.5 26.31,3.2 27.69,4.57 28.96,4.57 29.46,5.08 31.24,5.08 33.24,7.08 | 33.24,7.08 33.66,7.49 v34.04,7.49 | R15.1 12.45,16.26 10.93,17.78 9.14,17.78 | 9.14,17.78 | 9.14,17.78 X101.4 | 33.24,7.08 34.08,7.2 v34.04,7.49 | 33.24,7.08 33.82,7.7 v34.04,7.49 | 29.21,8.64 v29.84,8 | 33.24,7.08 34.07,7.17 v34.04,7.49 | 33.24,7.08 33.79,7.71 v34.04,7.49 | 29.21,8.64 29.55,7.87 v29.84,8 | 29.21,8.64 29.98,8.3 v29.84,8 | 9.14,17.78 8.49,18.26 | 9.14,17.78 8.49,18.26 | 8.49,18.26 | 9.14,17.78 | 9.14,17.78 8.49,18.26 | X101.4 8.49,18.26 | 9.14,17.78 | 9.14,17.78 8.49,18.26 | 9.14,17.78 | 9.14,17.78 8.49,17.29 | X101.4 8.49,17.29 | 7.41,18.49 7.53,17.69 X101.4 | 7.41,18.49 8.21,18.38 X101.4 | 9.14,17.78 8.49,18.26 | 8.49,18.26 | 9.14,17.78 8.49,17.29 | 9.14,17.78 8.49,18.26 | X101.4 8.49,18.26 | 9.14,17.78 8.49,17.29 | 8.49,17.29 | X101.4 8.49,17.29 | 9.14,17.78 8.49,18.26 | X101.4 8.49,18.26 | 9.14,17.78 8.49,17.29 | X101.4 8.49,17.29 | 9.14,17.78 8.49,18.26 | X101.4 8.49,18.26 | 9.14,17.78 8.49,17.29 | X101.4 8.49,17.29
  Bottom 0.305: v29.84,8 30.48,7.37 | 30.48,7.37 30.73,7.11 33.22,7.11 | 33.22,7.11 33.66,7.11 v34.04,7.49 | 33.22,7.11 34.06,7.19 v34.04,7.49 | 33.22,7.11 33.83,7.71 v34.04,7.49 | 30.48,7.37 30.12,8.13 v29.84,8 | 30.48,7.37 29.72,7.73 v29.84,8 | 33.22,7.11 34.06,7.17 v34.04,7.49 | 33.22,7.11 33.8,7.72 v34.04,7.49 | 30.48,7.37 30.14,8.13 v29.84,8 | 30.48,7.37 29.71,7.7 v29.84,8
PB4  (via drill 0.6)
  Top 0.305: R19.1 29.83,11.68 | 29.83,11.68 v30.73,11.68 | X1.6 23.57,3.51 24.64,4.57 26.92,4.57 27.43,5.08 28.7,5.08 29.21,5.59 30.99,5.59 36.07,10.67 36.07,14.22 | X100.2 36.07,14.22 | 36.07,14.22 | 29.83,11.68 30.63,11.4 v30.73,11.68 | 29.83,11.68 30.63,11.97 v30.73,11.68 | 29.83,11.68 30.62,11.38 | 30.62,11.38 | 29.83,11.68 30.62,11.38 | v30.73,11.68 30.62,11.38 | 29.83,11.68 30.62,11.99 | 30.62,11.99 | 29.83,11.68 | 29.83,11.68 30.62,11.99 | v30.73,11.68 30.62,11.99 | 29.83,11.68 30.62,11.38 | 30.62,11.38 | 29.83,11.68 30.62,11.38 | v30.73,11.68 30.62,11.38 | 29.83,11.68 30.62,11.99 | 30.62,11.99 | v30.73,11.68 30.62,11.99 | 29.83,11.68 30.62,11.38 | 29.83,11.68 30.62,11.99 | 29.83,11.68 30.62,11.38 | v30.73,11.68 30.62,11.38 | 29.83,11.68 30.62,11.99 | v30.73,11.68 30.62,11.99 | 36.07,14.22 36.56,14.87 | 36.07,14.22 36.56,14.87 | 36.56,14.87 | 36.07,14.22 | 36.07,14.22 36.56,14.87 | X100.2 36.56,14.87 | 36.07,14.22 | 36.07,14.22 36.56,14.87 | 36.07,14.22 | 36.07,14.22 35.58,14.87 | X100.2 35.58,14.87 | 36.07,14.22 36.56,14.87 | 36.56,14.87 | 36.07,14.22 35.58,14.87 | 36.07,14.22 36.56,14.87 | X100.2 36.56,14.87 | 36.07,14.22 35.58,14.87 | 35.58,14.87 | X100.2 35.58,14.87 | 36.07,14.22 36.56,14.87 | X100.2 36.56,14.87 | 36.07,14.22 35.58,14.87 | X100.2 35.58,14.87 | 36.07,14.22 36.56,14.87 | X100.2 36.56,14.87 | 36.07,14.22 35.58,14.87 | X100.2 35.58,14.87
  Bottom 0.305: v30.73,11.68 31.63,11.68 | 31.63,11.68 32.52,11.68 35.35,14.52 | 35.35,14.52 X100.2 | 31.63,11.68 30.83,11.97 v30.73,11.68 | 31.63,11.68 30.83,11.4 v30.73,11.68 | 31.63,11.68 30.85,11.99 | 30.85,11.99 | 31.63,11.68 30.85,11.99 | v30.73,11.68 30.85,11.99 | 31.63,11.68 | 31.63,11.68 30.85,11.38 | 30.85,11.38 | 31.63,11.68 30.85,11.38 | v30.73,11.68 30.85,11.38 | 31.63,11.68 30.85,11.38 | 30.85,11.38 | 31.63,11.68 30.85,11.99 | 30.85,11.99 | v30.73,11.68 30.85,11.99 | 31.63,11.68 30.85,11.38 | v30.73,11.68 30.85,11.38 | 31.63,11.68 30.85,11.99 | v30.73,11.68 30.85,11.99 | 31.63,11.68 30.85,11.38 | v30.73,11.68 30.85,11.38 | 35.35,14.52 36.15,14.63 X100.2 | 35.35,14.52 35.46,15.32 X100.2
PB5  (via drill 0.6)
  Top 0.305: R18.1 29.83,13.97 | 29.83,13.97 v30.73,13.97 | X100.1 33.53,14.22 | 33.53,14.22 | 33.53,14.22 33.53,8.89 30.73,6.1 28.96,6.1 28.45,5.59 27.18,5.59 26.67,5.08 22.61,5.08 20.83,3.3 X1.7 | 29.83,13.97 30.63,13.69 v30.73,13.97 | 29.83,13.97 30.63,14.25 v30.73,13.97 | 29.83,13.97 30.62,13.67 | 30.62,13.67 | 29.83,13.97 30.62,13.67 | v30.73,13.97 30.62,13.67 | 29.83,13.97 30.62,14.27 | 30.62,14.27 | 29.83,13.97 | 29.83,13.97 30.62,14.27 | v30.73,13.97 30.62,14.27 | 29.83,13.97 30.62,13.67 | 30.62,13.67 | 29.83,13.97 30.62,13.67 | v30.73,13.97 30.62,13.67 | 29.83,13.97 30.62,14.27 | 30.62,14.27 | v30.73,13.97 30.62,14.27 | 29.83,13.97 30.62,13.67 | 29.83,13.97 30.62,14.27 | 29.83,13.97 30.62,13.67 | v30.73,13.97 30.62,13.67 | 29.83,13.97 30.62,14.27 | v30.73,13.97 30.62,14.27 | 33.53,14.22 34.02,14.87 | 33.53,14.22 34.02,14.87 | 34.02,14.87 | 33.53,14.22 | 33.53,14.22 34.02,14.87 | X100.1 34.02,14.87 | 33.53,14.22 | 33.53,14.22 34.02,14.87 | 33.53,14.22 | 33.53,14.22 33.04,14.87 | X100.1 33.04,14.87 | 33.53,14.22 34.02,14.87 | 34.02,14.87 | 33.53,14.22 33.04,14.87 | 33.53,14.22 34.02,14.87 | X100.1 34.02,14.87 | 33.53,14.22 33.04,14.87 | 33.04,14.87 | X100.1 33.04,14.87 | 33.53,14.22 34.02,14.87 | X100.1 34.02,14.87 | 33.53,14.22 33.04,14.87 | X100.1 33.04,14.87 | 33.53,14.22 34.02,14.87 | X100.1 34.02,14.87 | 33.53,14.22 33.04,14.87 | X100.1 33.04,14.87
  Bottom 0.305: v30.73,13.97 31.37,14.61 | 31.37,14.61 32,15.24 32.51,15.24 | 32.51,15.24 | 32.51,15.24 X100.1 | 31.37,14.61 30.61,14.24 v30.73,13.97 | 31.37,14.61 31,13.84 v30.73,13.97 | 31.37,14.61 30.6,14.27 v30.73,13.97 | 31.37,14.61 31.03,13.84 v30.73,13.97 | 32.51,15.24 33.16,14.75 | 33.16,14.75 | 32.51,15.24 33.16,15.72 | 32.51,15.24 | 32.51,15.24 33.16,14.75 | X100.1 33.16,14.75 | 32.51,15.24 33.16,15.72 | 32.51,15.24 | 32.51,15.24 | 32.51,15.24 33.16,15.72 | X100.1 33.16,15.72 | 32.51,15.24 33.16,14.75 | 32.51,15.24 33.16,15.72 | 33.16,15.72 | X100.1 33.16,15.72 | 32.51,15.24 33.16,14.75 | 33.16,14.75 | 32.51,15.24 33.16,14.75 | X100.1 33.16,14.75 | 32.51,15.24 33.16,15.72 | 33.16,15.72 | 32.51,15.24 33.16,14.75 | X100.1 33.16,14.75 | 32.51,15.24 33.16,15.72 | X100.1 33.16,15.72 | 32.51,15.24 33.16,14.75 | X100.1 33.16,14.75 | 32.51,15.24 33.16,15.72 | X100.1 33.16,15.72
PB6
  Top 0.305: 35.35,17.06 34.8,16.51 32.77,16.51 32.26,16 32.26,8.38 30.48,6.6 28.7,6.6 28.19,6.1 26.92,6.1 26.42,5.59 22.35,5.59 21.34,4.57 19.3,4.57 18.03,3.3 18.03,2.23 X1.8 | 35.35,17.06 X100.4 | 35.35,18.49 34.79,19.05 26.42,19.05 25.91,18.54 R14.1 | 35.35,18.49 X100.4 | 35.35,17.06 36.15,17.17 X100.4 | 35.35,17.06 35.46,17.86 X100.4 | 35.35,18.49 35.46,17.69 X100.4 | 35.35,18.49 36.15,18.38 X100.4
PB7
  Top 0.305: X1.9 15.34,3.15 16.76,4.57 18.54,4.57 19.05,5.08 21.08,5.08 22.1,6.1 26.16,6.1 26.67,6.6 27.94,6.6 28.45,7.11 30.23,7.11 31.75,8.64 31.75,16.26 | 31.75,16.26 31.75,17.02 32.51,17.78 | X100.3 32.51,17.78 | 32.51,17.78 | R16.1 31.75,16.26 | 32.51,17.78 33.16,17.29 | 33.16,17.29 | 32.51,17.78 33.16,18.26 | 32.51,17.78 | 32.51,17.78 33.16,17.29 | X100.3 33.16,17.29 | 32.51,17.78 33.16,18.26 | 32.51,17.78 | 32.51,17.78 | 32.51,17.78 33.16,18.26 | X100.3 33.16,18.26 | 32.51,17.78 33.16,17.29 | 32.51,17.78 33.16,18.26 | 33.16,18.26 | X100.3 33.16,18.26 | 32.51,17.78 33.16,17.29 | 33.16,17.29 | 32.51,17.78 33.16,17.29 | X100.3 33.16,17.29 | 32.51,17.78 33.16,18.26 | 33.16,18.26 | 32.51,17.78 33.16,17.29 | X100.3 33.16,17.29 | 32.51,17.78 33.16,18.26 | X100.3 33.16,18.26 | 32.51,17.78 33.16,17.29 | X100.3 33.16,17.29 | 32.51,17.78 33.16,18.26 | X100.3 33.16,18.26
PD0  (via drill 0.6)
  Top 0.305: v21.46,25.27 21.46,24.37 | 21.46,24.37 21.46,23.25 | 21.46,23.25 v21.46,22.35 | 21.46,24.37 21.75,25.17 v21.46,25.27 | 21.46,24.37 21.18,25.17 v21.46,25.27 | 21.46,23.25 21.18,22.45 v21.46,22.35 | 21.46,23.25 21.75,22.45 v21.46,22.35 | 21.46,24.37 21.77,25.16 | 21.77,25.16 | 21.46,24.37 21.77,25.16 | v21.46,25.27 21.77,25.16 | 21.46,24.37 | 21.46,24.37 21.16,25.16 | 21.16,25.16 | 21.46,24.37 21.16,25.16 | v21.46,25.27 21.16,25.16 | 21.46,24.37 21.16,25.16 | 21.16,25.16 | 21.46,24.37 21.77,25.16 | 21.77,25.16 | v21.46,25.27 21.77,25.16 | 21.46,24.37 21.16,25.16 | v21.46,25.27 21.16,25.16 | 21.46,24.37 21.77,25.16 | v21.46,25.27 21.77,25.16 | 21.46,24.37 21.16,25.16 | v21.46,25.27 21.16,25.16 | 21.46,23.25 21.16,22.47 | 21.16,22.47 | 21.46,23.25 21.16,22.47 | v21.46,22.35 21.16,22.47 | 21.46,23.25 21.77,22.47 | 21.77,22.47 | 21.46,23.25 | 21.46,23.25 21.77,22.47 | v21.46,22.35 21.77,22.47 | 21.46,23.25 21.16,22.47 | 21.16,22.47 | 21.46,23.25 21.16,22.47 | v21.46,22.35 21.16,22.47 | 21.46,23.25 21.77,22.47 | 21.77,22.47 | v21.46,22.35 21.77,22.47 | 21.46,23.25 21.16,22.47 | 21.46,23.25 21.77,22.47 | 21.46,23.25 21.16,22.47 | v21.46,22.35 21.16,22.47 | 21.46,23.25 21.77,22.47 | v21.46,22.35 21.77,22.47
  Bottom 0.305: 21.08,21.54 21.08,6.6 19.81,5.33 18.03,5.33 16.71,4.01 X1.21 | 21.08,21.54 21.08,21.84 21.46,22.23 v21.46,22.35 | 32.51,33.02 30.98,33.02 28.96,30.99 28.96,30.23 24,25.27 22.36,25.27 | 32.51,33.02 | 32.51,33.02 X100.15 | 22.36,25.27 v21.46,25.27 | 22.36,25.27 21.56,25.56 v21.46,25.27 | 22.36,25.27 21.56,24.99 v21.46,25.27 | 21.08,21.54 21.68,22.14 v21.46,22.35 | 21.08,21.54 21.16,22.38 v21.46,22.35 | 22.36,25.27 21.58,25.58 | 21.58,25.58 | 22.36,25.27 21.58,25.58 | v21.46,25.27 21.58,25.58 | 22.36,25.27 | 22.36,25.27 21.58,24.97 | 21.58,24.97 | 22.36,25.27 21.58,24.97 | v21.46,25.27 21.58,24.97 | 22.36,25.27 21.58,24.97 | 21.58,24.97 | 22.36,25.27 21.58,25.58 | 21.58,25.58 | v21.46,25.27 21.58,25.58 | 22.36,25.27 21.58,24.97 | v21.46,25.27 21.58,24.97 | 22.36,25.27 21.58,25.58 | v21.46,25.27 21.58,25.58 | 22.36,25.27 21.58,24.97 | v21.46,25.27 21.58,24.97 | 21.08,21.54 21.69,22.12 v21.46,22.35 | 21.08,21.54 21.14,22.37 v21.46,22.35 | 32.51,33.02 33.16,32.53 | 33.16,32.53 | 32.51,33.02 33.16,33.5 | 32.51,33.02 | 32.51,33.02 33.16,32.53 | X100.15 33.16,32.53 | 32.51,33.02 33.16,33.5 | 32.51,33.02 | 32.51,33.02 | 32.51,33.02 33.16,33.5 | X100.15 33.16,33.5 | 32.51,33.02 33.16,32.53 | 32.51,33.02 33.16,33.5 | 33.16,33.5 | X100.15 33.16,33.5 | 32.51,33.02 33.16,32.53 | 33.16,32.53 | 32.51,33.02 33.16,32.53 | X100.15 33.16,32.53 | 32.51,33.02 33.16,33.5 | 33.16,33.5 | 32.51,33.02 33.16,32.53 | X100.15 33.16,32.53 | 32.51,33.02 33.16,33.5 | X100.15 33.16,33.5 | 32.51,33.02 33.16,32.53 | X100.15 33.16,32.53 | 32.51,33.02 33.16,33.5 | X100.15 33.16,33.5
PD1  (via drill 0.6)  (13 unrouted)
  Top 0.305: v20.32,25.27 20.32,24.37 | 20.32,24.37 20.32,23.25 | 20.32,23.25 v20.32,22.35 | 20.32,24.37 20.6,25.17 v20.32,25.27 | 20.32,24.37 20.04,25.17 v20.32,25.27 | 20.32,23.25 20.04,22.45 v20.32,22.35 | 20.32,23.25 20.6,22.45 v20.32,22.35 | 20.32,24.37 20.62,25.16 | 20.62,25.16 | 20.32,24.37 20.62,25.16 | v20.32,25.27 20.62,25.16 | 20.32,24.37 | 20.32,24.37 20.02,25.16 | 20.02,25.16 | 20.32,24.37 20.02,25.16 | v20.32,25.27 20.02,25.16 | 20.32,24.37 20.02,25.16 | 20.02,25.16 | 20.32,24.37 20.62,25.16 | 20.62,25.16 | 20.32,24.37 20.02,25.16 | v20.32,25.27 20.02,25.16 | 20.32,24.37 20.62,25.16 | v20.32,25.27 20.62,25.16 | 20.32,24.37 20.02,25.16 | v20.32,25.27 20.02,25.16 | 20.32,23.25 20.02,22.47 | 20.02,22.47 | 20.32,23.25 20.02,22.47 | v20.32,22.35 20.02,22.47 | 20.32,23.25 20.62,22.47 | 20.62,22.47 | 20.32,23.25 | 20.32,23.25 20.62,22.47 | v20.32,22.35 20.62,22.47 | 20.32,23.25 20.02,22.47 | 20.02,22.47 | 20.32,23.25 20.02,22.47 | v20.32,22.35 20.02,22.47 | 20.32,23.25 20.62,22.47 | 20.62,22.47 | v20.32,22.35 20.62,22.47 | 20.32,23.25 20.02,22.47 | 20.32,23.25 20.62,22.47 | 20.32,23.25 20.02,22.47 | v20.32,22.35 20.02,22.47 | 20.32,23.25 20.62,22.47 | v20.32,22.35 20.62,22.47
  Bottom 0.305: 20.32,21.45 20.32,6.86 19.56,6.1 18.03,6.1 16.76,4.83 14.73,4.83 13.97,4.06 X1.22 | 20.32,21.45 v20.32,22.35 | X100.18 35.35,34.84 | 35.35,34.84 34.8,34.29 31.5,34.29 28.45,31.24 28.45,30.48 24.13,26.16 20.57,26.16 20.55,26.14 | 20.32,21.45 20.6,22.25 v20.32,22.35 | 20.32,21.45 20.04,22.25 v20.32,22.35 | 20.55,26.14 20.32,25.91 v20.32,25.27 | 20.55,26.14 | 20.55,26.14 20.06,25.46 | v20.32,25.27 20.06,25.46 | 20.55,26.14 | 20.55,26.14 20.64,25.31 | v20.32,25.27 20.64,25.31 | 20.55,26.14 20.06,25.46 | v20.32,25.27 20.06,25.46 | 20.55,26.14 20.64,25.31 | v20.32,25.27 20.64,25.31 | 20.55,26.14 20.06,25.46 | v20.32,25.27 20.06,25.46 | 20.55,26.14 20.64,25.31 | v20.32,25.27 20.64,25.31 | 20.32,21.45 20.62,22.23 | 20.62,22.23 | 20.32,21.45 20.62,22.23 | v20.32,22.35 20.62,22.23 | 20.32,21.45 | 20.32,21.45 20.02,22.23 | 20.02,22.23 | 20.32,21.45 20.02,22.23 | v20.32,22.35 20.02,22.23 | 20.32,21.45 20.02,22.23 | 20.02,22.23 | 20.32,21.45 20.62,22.23 | 20.62,22.23 | v20.32,22.35 20.62,22.23 | 20.32,21.45 20.02,22.23 | v20.32,22.35 20.02,22.23 | 20.32,21.45 20.62,22.23 | v20.32,22.35 20.62,22.23 | 20.32,21.45 20.02,22.23 | v20.32,22.35 20.02,22.23 | 35.35,34.84 36.15,34.95 X100.18 | 35.35,34.84 35.46,35.64 X100.18
PD2  (via drill 0.6)  (7 unrouted)
  Top 0.305: v19.18,25.27 19.18,24.37 | 19.18,24.37 19.18,23.25 | 19.18,23.25 v19.18,22.35 | 19.18,24.37 19.46,25.17 | 19.18,24.37 18.89,25.17 v19.18,25.27 | 19.18,23.25 18.89,22.45 v19.18,22.35 | 19.18,23.25 19.46,22.45 v19.18,22.35 | 19.18,24.37 19.48,25.16 | 19.48,25.16 | 19.18,24.37 19.48,25.16 | v19.18,25.27 19.48,25.16 | 19.18,24.37 | 19.18,24.37 18.87,25.16 | 18.87,25.16 | 19.18,24.37 18.87,25.16 | v19.18,25.27 18.87,25.16 | 19.18,24.37 18.87,25.16 | 18.87,25.16 | 19.18,24.37 19.48,25.16 | 19.48,25.16 | v19.18,25.27 19.48,25.16 | 19.18,24.37 18.87,25.16 | v19.18,25.27 18.87,25.16 | 19.18,24.37 19.48,25.16 | v19.18,25.27 19.48,25.16 | 19.18,24.37 18.87,25.16 | v19.18,25.27 18.87,25.16 | 19.18,23.25 18.87,22.47 | 18.87,22.47 | 19.18,23.25 18.87,22.47 | v19.18,22.35 18.87,22.47 | 19.18,23.25 19.48,22.47 | 19.48,22.47 | 19.18,23.25 | 19.18,23.25 19.48,22.47 | v19.18,22.35 19.48,22.47 | 19.18,23.25 18.87,22.47 | 18.87,22.47 | 19.18,23.25 18.87,22.47 | v19.18,22.35 18.87,22.47 | 19.18,23.25 19.48,22.47 | 19.48,22.47 | v19.18,22.35 19.48,22.47 | 19.18,23.25 18.87,22.47 | 19.18,23.25 19.48,22.47 | 19.18,23.25 18.87,22.47 | v19.18,22.35 18.87,22.47 | 19.18,23.25 19.48,22.47 | v19.18,22.35 19.48,22.47
  Bottom 0.305: 11.23,3.61 X1.23 11.23,4.12 12.45,5.33 16.26,5.33 17.53,6.6 19.05,6.6 19.56,7.11 19.56,21.54 | 19.56,21.54 19.56,21.84 19.18,22.23 v19.18,22.35 | 32.51,35.56 32,35.56 27.94,31.5 27.94,30.73 23.88,26.67 19.81,26.67 19.31,26.16 | 32.51,35.56 | 32.51,35.56 X100.17 | 19.56,21.54 19.48,22.38 v19.18,22.35 | 19.56,21.54 18.96,22.14 v19.18,22.35 | 19.31,26.16 19.18,26.04 v19.18,25.27 | 19.31,26.16 18.89,25.43 | v19.18,25.27 18.89,25.43 | 19.31,26.16 | 19.31,26.16 19.49,25.35 | v19.18,25.27 19.49,25.35 | 19.31,26.16 18.89,25.43 | v19.18,25.27 18.89,25.43 | 19.31,26.16 19.49,25.35 | v19.18,25.27 19.49,25.35 | 19.56,21.54 19.5,22.37 v19.18,22.35 | 19.56,21.54 18.95,22.12 v19.18,22.35 | 32.51,35.56 33.16,35.07 | 33.16,35.07 | 32.51,35.56 33.16,36.04 | 32.51,35.56 | 32.51,35.56 33.16,35.07 | X100.17 33.16,35.07 | 32.51,35.56 33.16,36.04 | 32.51,35.56 | 32.51,35.56 | 32.51,35.56 33.16,36.04 | X100.17 33.16,36.04 | 32.51,35.56 33.16,35.07 | 32.51,35.56 33.16,36.04 | 33.16,36.04 | X100.17 33.16,36.04 | 32.51,35.56 33.16,35.07 | 33.16,35.07 | 32.51,35.56 33.16,35.07 | X100.17 33.16,35.07 | 32.51,35.56 33.16,36.04 | 33.16,36.04 | 32.51,35.56 33.16,35.07 | X100.17 33.16,35.07 | 32.51,35.56 33.16,36.04 | X100.17 33.16,36.04 | 32.51,35.56 33.16,35.07 | X100.17 33.16,35.07 | 32.51,35.56 33.16,36.04 | X100.17 33.16,36.04
PD3
  Top 0.305: 35.35,37.38 34.8,36.83 32.77,36.83 31.5,35.56 31.5,29.72 30.86,29.08 R6.1 | 35.35,37.38 X100.20 | 35.35,37.38 36.15,37.49 X100.20 | 35.35,37.38 35.46,38.18 X100.20
  Bottom 0.305: 37.08,38.1 39.37,38.1 40.64,36.83 40.64,5.59 39.62,4.57 34.19,4.57 33.17,3.56 | 37.08,38.1 | 37.08,38.1 X100.20 | X1.15 33.17,3.56 | 33.17,3.56 33.17,3.71 | 37.08,38.1 36.43,38.58 | 37.08,38.1 36.43,38.58 | 36.43,38.58 | 37.08,38.1 | 37.08,38.1 36.43,38.58 | X100.20 36.43,38.58 | 37.08,38.1 | 37.08,38.1 36.43,38.58 | 37.08,38.1 | 37.08,38.1 36.43,37.61 | X100.20 36.43,37.61 | 37.08,38.1 36.43,38.58 | 36.43,38.58 | 37.08,38.1 36.43,37.61 | 37.08,38.1 36.43,38.58 | X100.20 36.43,38.58 | 37.08,38.1 36.43,37.61 | 36.43,37.61 | X100.20 36.43,37.61 | 37.08,38.1 36.43,38.58 | X100.20 36.43,38.58 | 37.08,38.1 36.43,37.61 | X100.20 36.43,37.61 | 37.08,38.1 36.43,38.58 | X100.20 36.43,38.58 | 37.08,38.1 36.43,37.61 | X100.20 36.43,37.61
PD4  (via drill 0.6)
  Top 0.305: X1.13 4.37,3.25 0.76,6.86 0.76,39.12 2.29,40.64 8.64,40.64 9.78,39.5 | 32.51,38.1 32.25,38.1 30.99,36.83 30.99,30.23 30.48,29.72 29.72,29.72 28.07,31.37 R4.1 | 32.51,38.1 | 32.51,38.1 X100.19 | 9.78,39.5 v10.41,38.86 | 9.78,39.5 10.14,38.73 v10.41,38.86 | 9.78,39.5 10.54,39.13 v10.41,38.86 | 9.78,39.5 10.12,38.73 v10.41,38.86 | 9.78,39.5 10.54,39.16 v10.41,38.86 | 32.51,38.1 33.16,37.61 | 33.16,37.61 | 32.51,38.1 33.16,38.58 | 32.51,38.1 | 32.51,38.1 33.16,37.61 | X100.19 33.16,37.61 | 32.51,38.1 33.16,38.58 | 32.51,38.1 | 32.51,38.1 | 32.51,38.1 33.16,38.58 | X100.19 33.16,38.58 | 32.51,38.1 33.16,37.61 | 32.51,38.1 33.16,38.58 | 33.16,38.58 | X100.19 33.16,38.58 | 32.51,38.1 33.16,37.61 | 33.16,37.61 | 32.51,38.1 33.16,37.61 | X100.19 33.16,37.61 | 32.51,38.1 33.16,38.58 | 33.16,38.58 | 32.51,38.1 33.16,37.61 | X100.19 33.16,37.61 | 32.51,38.1 33.16,38.58 | X100.19 33.16,38.58 | 32.51,38.1 33.16,37.61 | X100.19 33.16,37.61 | 32.51,38.1 33.16,38.58 | X100.19 33.16,38.58
  Bottom 0.305: v10.41,38.86 11.05,38.23 | 11.05,38.23 11.94,37.34 32.77,37.34 32.81,37.38 | 32.81,37.38 X100.19 | 11.05,38.23 10.69,38.99 v10.41,38.86 | 11.05,38.23 10.29,38.59 v10.41,38.86 | 11.05,38.23 10.71,38.99 v10.41,38.86 | 11.05,38.23 10.28,38.56 v10.41,38.86 | 32.81,37.38 33.61,37.49 X100.19 | 32.81,37.38 32.92,38.18 X100.19
PD5
  Top 0.305: X101.19 4.57,38.1 | 4.57,38.1 | 4.57,38.1 2.54,38.1 1.27,36.83 1.27,7.11 3.81,4.57 5.59,4.57 7.11,3.05 X1.12 | 6.31,37.38 6.85,36.83 8.64,36.83 9.91,35.56 9.91,32.26 13.08,29.08 R5.1 | 6.31,37.38 X101.19 | 4.57,38.1 5.22,37.61 | 5.22,37.61 | 4.57,38.1 5.22,38.58 | 4.57,38.1 | 4.57,38.1 5.22,37.61 | X101.19 5.22,37.61 | 4.57,38.1 5.22,38.58 | 4.57,38.1 | 4.57,38.1 | 4.57,38.1 5.22,38.58 | X101.19 5.22,38.58 | 4.57,38.1 5.22,37.61 | 4.57,38.1 5.22,38.58 | 5.22,38.58 | X101.19 5.22,38.58 | 4.57,38.1 5.22,37.61 | 5.22,37.61 | 4.57,38.1 5.22,37.61 | X101.19 5.22,37.61 | 4.57,38.1 5.22,38.58 | 5.22,38.58 | 4.57,38.1 5.22,37.61 | X101.19 5.22,37.61 | 4.57,38.1 5.22,38.58 | X101.19 5.22,38.58 | 4.57,38.1 5.22,37.61 | X101.19 5.22,37.61 | 4.57,38.1 5.22,38.58 | X101.19 5.22,38.58 | 6.31,37.38 6.19,38.18 X101.19 | 6.31,37.38 5.5,37.49 X101.19
PD6  (via drill 0.6)
  Top 0.305: X101.13 4.57,30.48 | 4.57,30.48 | 4.57,30.48 4.45,30.48 | 4.45,30.48 v3.55,30.48 | v3.55,30.48 2.98,29.78 | 2.98,29.78 2.29,28.96 2.29,7.62 4.32,5.59 10.16,5.59 12.6,3.15 X1.10 | X101.20 7.41,38.81 | 7.41,38.81 6.6,39.62 4.46,39.62 | 4.46,39.62 v3.56,39.62 | X101.20 8.85,37.38 | 8.85,37.38 10.41,35.81 10.41,32.51 11.56,31.37 R3.1 | 4.46,39.62 3.66,39.91 v3.56,39.62 | 4.46,39.62 3.66,39.34 v3.56,39.62 | 4.45,30.48 3.65,30.76 v3.55,30.48 | 4.45,30.48 3.65,30.19 v3.55,30.48 | 2.98,29.78 3.71,30.22 v3.55,30.48 | 2.98,29.78 3.27,30.58 v3.55,30.48 | 2.98,29.78 | 2.98,29.78 3.71,30.19 | 2.98,29.78 | 2.98,29.78 3.71,30.19 | 4.46,39.62 3.67,39.93 | 3.67,39.93 | 4.46,39.62 3.67,39.93 | v3.56,39.62 3.67,39.93 | 4.46,39.62 | 4.46,39.62 3.67,39.32 | 3.67,39.32 | 4.46,39.62 3.67,39.32 | v3.56,39.62 3.67,39.32 | 4.46,39.62 3.67,39.32 | 3.67,39.32 | 4.46,39.62 3.67,39.93 | 3.67,39.93 | v3.56,39.62 3.67,39.93 | 4.46,39.62 3.67,39.32 | v3.56,39.62 3.67,39.32 | 4.46,39.62 3.67,39.93 | v3.56,39.62 3.67,39.93 | 4.46,39.62 3.67,39.32 | v3.56,39.62 3.67,39.32 | 4.45,30.48 3.67,30.78 | 3.67,30.78 | 4.45,30.48 3.67,30.78 | v3.55,30.48 3.67,30.78 | 4.45,30.48 | 4.45,30.48 3.67,30.17 | 3.67,30.17 | 4.45,30.48 3.67,30.17 | v3.55,30.48 3.67,30.17 | 3.71,30.19 | 2.98,29.78 3.24,30.58 | 3.24,30.58 | 4.45,30.48 3.67,30.17 | 3.67,30.17 | 4.45,30.48 3.67,30.78 | 3.67,30.78 | v3.55,30.48 3.67,30.78 | 4.45,30.48 3.67,30.17 | v3.55,30.48 3.67,30.17 | 4.45,30.48 3.67,30.78 | v3.55,30.48 3.67,30.78 | 4.45,30.48 3.67,30.17 | v3.55,30.48 3.67,30.17 | 2.98,29.78 3.71,30.19 | v3.55,30.48 3.71,30.19 | 2.98,29.78 3.24,30.58 | v3.55,30.48 3.24,30.58 | 2.98,29.78 3.71,30.19 | v3.55,30.48 3.71,30.19 | 2.98,29.78 3.24,30.58 | v3.55,30.48 3.24,30.58
  Top 0.305: 4.57,30.48 5.22,29.99 | 5.22,29.99 | 7.41,38.81 7.53,38.01 X101.20 | 7.41,38.81 8.21,38.7 X101.20 | 8.85,37.38 8.73,38.18 X101.20 | 8.85,37.38 8.04,37.49 X101.20 | 4.57,30.48 5.22,30.96 | 4.57,30.48 | 4.57,30.48 5.22,29.99 | X101.13 5.22,29.99 | 4.57,30.48 5.22,30.96 | 4.57,30.48 | 4.57,30.48 | 4.57,30.48 5.22,30.96 | X101.13 5.22,30.96 | 4.57,30.48 5.22,29.99 | 4.57,30.48 5.22,30.96 | 5.22,30.96 | X101.13 5.22,30.96 | 4.57,30.48 5.22,29.99 | 5.22,29.99 | 4.57,30.48 5.22,29.99 | X101.13 5.22,29.99 | 4.57,30.48 5.22,30.96 | 5.22,30.96 | 4.57,30.48 5.22,29.99 | X101.13 5.22,29.99 | 4.57,30.48 5.22,30.96 | X101.13 5.22,30.96 | 4.57,30.48 5.22,29.99 | X101.13 5.22,29.99 | 4.57,30.48 5.22,30.96 | X101.13 5.22,30.96
  Bottom 0.305: v3.56,39.62 v3.55,39.62 3.55,38.72 | 3.55,38.72 3.55,31.38 | 3.55,31.38 v3.55,30.48 | 3.55,38.72 3.84,39.52 v3.56,39.62 | 3.55,38.72 3.27,39.53 v3.56,39.62 | 3.55,31.38 3.27,30.58 v3.55,30.48 | 3.55,31.38 3.83,30.58 v3.55,30.48 | 3.55,38.72 3.86,39.5 v3.56,39.62 | 3.55,38.72 3.25,39.51 v3.56,39.62 | 3.55,31.38 3.25,30.59 | 3.25,30.59 | 3.55,31.38 3.25,30.59 | v3.55,30.48 3.25,30.59 | 3.55,31.38 3.85,30.59 | 3.85,30.59 | 3.55,31.38 | 3.55,31.38 3.85,30.59 | v3.55,30.48 3.85,30.59 | 3.55,31.38 3.25,30.59 | 3.25,30.59 | 3.55,31.38 3.25,30.59 | v3.55,30.48 3.25,30.59 | 3.55,31.38 3.85,30.59 | 3.85,30.59 | v3.55,30.48 3.85,30.59 | 3.55,31.38 3.25,30.59 | 3.55,31.38 3.85,30.59 | 3.55,31.38 3.25,30.59 | v3.55,30.48 3.25,30.59 | 3.55,31.38 3.85,30.59 | v3.55,30.48 3.85,30.59
PD7
  Top 0.305: X101.17 4.57,35.56 | 4.57,35.56 | 4.57,35.56 3.55,35.56 1.78,33.78 1.78,7.37 4.06,5.08 7.87,5.08 9.91,3.05 9.91,2.23 X1.11 | 9.14,30.48 10.74,30.48 14.42,26.8 R7.1 | 9.14,30.48 | 9.14,30.48 X101.14 | 4.57,35.56 5.22,35.07 | 5.22,35.07 | 4.57,35.56 5.22,36.04 | 4.57,35.56 | 4.57,35.56 5.22,35.07 | X101.17 5.22,35.07 | 4.57,35.56 5.22,36.04 | 4.57,35.56 | 4.57,35.56 | 4.57,35.56 5.22,36.04 | X101.17 5.22,36.04 | 4.57,35.56 5.22,35.07 | 4.57,35.56 5.22,36.04 | 5.22,36.04 | X101.17 5.22,36.04 | 4.57,35.56 5.22,35.07 | 5.22,35.07 | 4.57,35.56 5.22,35.07 | X101.17 5.22,35.07 | 4.57,35.56 5.22,36.04 | 5.22,36.04 | 4.57,35.56 5.22,35.07 | X101.17 5.22,35.07 | 4.57,35.56 5.22,36.04 | X101.17 5.22,36.04 | 4.57,35.56 5.22,35.07 | X101.17 5.22,35.07 | 4.57,35.56 5.22,36.04 | X101.17 5.22,36.04 | 9.14,30.48 8.49,30.96 | 9.14,30.48 8.49,30.96 | 8.49,30.96 | 9.14,30.48 | 9.14,30.48 8.49,30.96 | X101.14 8.49,30.96 | 9.14,30.48 | 9.14,30.48 8.49,30.96 | 9.14,30.48 | 9.14,30.48 8.49,29.99 | X101.14 8.49,29.99 | 9.14,30.48 8.49,30.96 | 8.49,30.96 | 9.14,30.48 8.49,29.99 | 9.14,30.48 8.49,30.96 | X101.14 8.49,30.96 | 9.14,30.48 8.49,29.99 | 8.49,29.99 | X101.14 8.49,29.99 | 9.14,30.48 8.49,30.96 | X101.14 8.49,30.96 | 9.14,30.48 8.49,29.99 | X101.14 8.49,29.99 | 9.14,30.48 8.49,30.96 | X101.14 8.49,30.96 | 9.14,30.48 8.49,29.99 | X101.14 8.49,29.99
  Bottom 0.305: X101.17 6.31,34.84 | 6.31,34.84 6.86,34.29 6.86,31.75 7.41,31.19 | 7.41,31.19 X101.14 | 6.31,34.84 6.19,35.64 X101.17 | 6.31,34.84 5.5,34.95 X101.17 | 7.41,31.19 7.53,30.39 X101.14 | 7.41,31.19 8.21,31.08 X101.14
PULL-UPS
  Top 0.305: R19.2 R18.2 | R17.2 R18.2 | R4.2 R6.2 R8.2 22.16,26.1 22.93,25.33 R10.2 22.86,23.56 22.86,22.1 22.16,21.4 R12.2 R14.2 R16.2 R18.2 | R3.2 R5.2 R7.2 18.48,26.1 17.71,25.33 R9.2 17.78,23.56 17.78,22.1 18.48,21.4 R11.2 R13.2 R15.2 R17.2 | Q1.3 18.48,10.44 R17.2
VSELECT  (via drill 0.6)
  Top 0.305: v14.48,9.4 13.58,9.4 | 13.58,9.4 12.77,9.4 R20.1 | Q1.2 16.44,9.46 16.51,9.4 15.38,9.4 | 15.38,9.4 v14.48,9.4 | 13.58,9.4 14.38,9.12 v14.48,9.4 | 13.58,9.4 14.38,9.68 v14.48,9.4 | 15.38,9.4 14.58,9.68 v14.48,9.4 | 15.38,9.4 14.58,9.12 v14.48,9.4 | 13.58,9.4 14.36,9.1 | 14.36,9.1 | 15.38,9.4 14.6,9.7 | 14.6,9.7 | 13.58,9.4 14.36,9.1 | v14.48,9.4 14.36,9.1 | 13.58,9.4 14.36,9.7 | 14.36,9.7 | 13.58,9.4 | 13.58,9.4 14.36,9.7 | v14.48,9.4 14.36,9.7 | 15.38,9.4 14.6,9.7 | v14.48,9.4 14.6,9.7 | 15.38,9.4 | 15.38,9.4 14.6,9.1 | 14.6,9.1 | 15.38,9.4 14.6,9.1 | v14.48,9.4 14.6,9.1 | 13.58,9.4 14.36,9.1 | 14.36,9.1 | 13.58,9.4 14.36,9.1 | v14.48,9.4 14.36,9.1 | 13.58,9.4 14.36,9.7 | 14.36,9.7 | v14.48,9.4 14.36,9.7 | 13.58,9.4 14.36,9.1 | 13.58,9.4 14.36,9.7 | 13.58,9.4 14.36,9.1 | v14.48,9.4 14.36,9.1 | 13.58,9.4 14.36,9.7 | v14.48,9.4 14.36,9.7 | 15.38,9.4 14.6,9.1 | 14.6,9.1 | 15.38,9.4 14.6,9.7 | 14.6,9.7 | v14.48,9.4 14.6,9.7 | 15.38,9.4 14.6,9.1 | v14.48,9.4 14.6,9.1 | 15.38,9.4 14.6,9.7 | v14.48,9.4 14.6,9.7 | 15.38,9.4 14.6,9.1 | v14.48,9.4 14.6,9.1
  Bottom 0.305: 13.84,10.03 13.21,10.67 13.21,35.81 13.72,36.32 18.8,36.32 19.75,35.36 VSELECT.2 | 13.84,10.03 v14.48,9.4 | 13.84,10.03 14.21,9.27 v14.48,9.4 | 13.84,10.03 14.61,9.67 v14.48,9.4 | 13.84,10.03 14.18,9.27 v14.48,9.4 | 13.84,10.03 14.61,9.7 v14.48,9.4
  Bottom 0.61: 19.75,35.36 19.79,34.77 VSELECT.2 20.35,35.33 19.75,35.36

## Text on the board
tNames: +5V in
tDocu: +3.3V IO | +5V IO | 13 | 1
bDocu: Connect to host board / +5Vdc source | USB2LPT 1.7 adapter / v1.0 / Benjamin Fiset-Deschênes / www.benjaminfd.com / Licensed under GPLv3 | Original work by Henrik Haftmann | 25 | 14